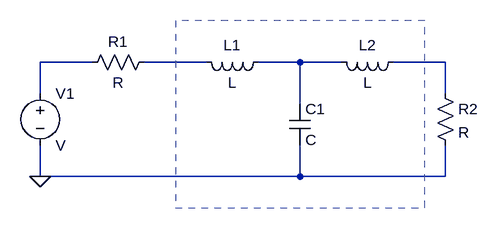
[diagram p0: schematic simulacion_ts13.asc]
simulacion_ts13.asc, the LTspice schematic file:
Version 4
SHEET 1 880 680
WIRE 128 80 48 80
WIRE 304 80 208 80
WIRE 448 80 384 80
WIRE 512 80 448 80
WIRE 672 80 592 80
WIRE 48 128 48 80
WIRE 672 128 672 80
WIRE 448 144 448 80
WIRE 48 256 48 208
WIRE 448 256 448 208
WIRE 448 256 48 256
WIRE 672 256 672 208
WIRE 672 256 448 256
FLAG 48 256 0
SYMBOL voltage 48 112 R0
SYMATTR InstName V1
SYMBOL res 224 64 R90
WINDOW 0 0 56 VBottom 2
WINDOW 3 32 56 VTop 2
SYMATTR InstName R1
SYMBOL ind 400 64 R90
WINDOW 0 5 56 VBottom 2
WINDOW 3 32 56 VTop 2
SYMATTR InstName L1
SYMBOL ind 608 64 R90
WINDOW 0 5 56 VBottom 2
WINDOW 3 32 56 VTop 2
SYMATTR InstName L2
SYMBOL res 656 112 R0
SYMATTR InstName R2
SYMBOL cap 432 144 R0
SYMATTR InstName C1
RECTANGLE Normal 640 16 256 304 2

The netlist it stands for:
* simulacion_ts13.asc
V1 N001 0 V
R1 N002 N001 R
L1 N003 N002 L
L2 N004 N003 L
R2 N004 0 R
C1 N003 0 C
.backanno
.end